# Altium schematic sheet label-signature_schematic.SchDoc
size A
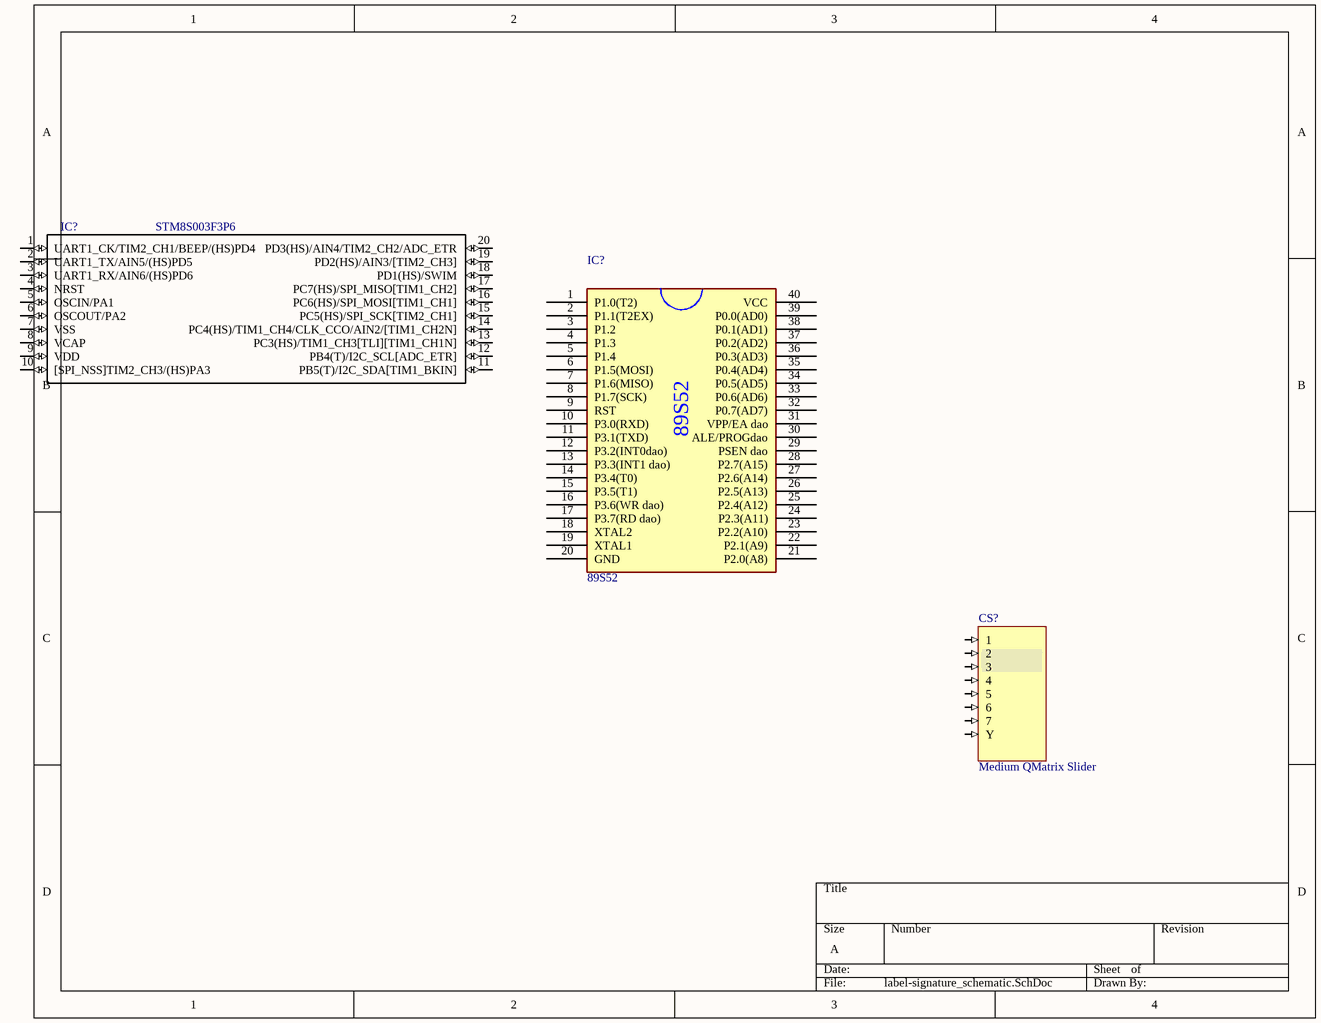
[diagram p0: label-signature_schematic.SchDoc]

## Parts
(Parts that share a designator on the sheet are numbered #1, #2 ... from top to bottom, then left to right.)
CS?  Medium QMatrix Slider  (no BOM)
IC?#1  STM8S003F3P6  [TSSOP20]
IC?#2  89S52  [89S52]

## Nets

Not connected (* = marked no-connect by the designer): CS? 1 2 3 4 5 6 7 Y; IC?#1 1(UART1_CK/TIM2_CH1/BEEP/(HS)PD4) 2(UART1_TX/AIN5/(HS)PD5) 3(UART1_RX/AIN6/(HS)PD6) 4(NRST) 5(OSCIN/PA1) 6(OSCOUT/PA2) 7(VSS) 8(VCAP) 9(VDD) 10([SPI_NSS]TIM2_CH3/(HS)PA3) 11(PB5(T)/I2C_SDA[TIM1_BKIN]) 12(PB4(T)/I2C_SCL[ADC_ETR]) 13(PC3(HS)/TIM1_CH3[TLI][TIM1_CH1N]) 14(PC4(HS)/TIM1_CH4/CLK_CCO/AIN2/[TIM1_CH2N]) 15(PC5(HS)/SPI_SCK[TIM2_CH1]) 16(PC6(HS)/SPI_MOSI[TIM1_CH1]) 17(PC7(HS)/SPI_MISO[TIM1_CH2]) 18(PD1(HS)/SWIM) 19(PD2(HS)/AIN3/[TIM2_CH3]) 20(PD3(HS)/AIN4/TIM2_CH2/ADC_ETR); IC?#2 1(P1.0(T2)) 2(P1.1(T2EX)) 3(P1.2) 4(P1.3) 5(P1.4) 6(P1.5(MOSI)) 7(P1.6(MISO)) 8(P1.7(SCK)) 9(RST) 10(P3.0(RXD)) 11(P3.1(TXD)) 12(P3.2(INT0dao)) 13(P3.3(INT1_dao)) 14(P3.4(T0)) 15(P3.5(T1)) 16(P3.6(WR_dao)) 17(P3.7(RD_dao)) 18(XTAL2) 19(XTAL1) 20(GND) 21(P2.0(A8)) 22(P2.1(A9)) 23(P2.2(A10)) 24(P2.3(A11)) 25(P2.4(A12)) 26(P2.5(A13)) 27(P2.6(A14)) 28(P2.7(A15)) 29(PSEN_dao) 30(ALE/PROGdao) 31(VPP/EA_dao) 32(P0.7(AD7)) 33(P0.6(AD6)) 34(P0.5(AD5)) 35(P0.4(AD4)) 36(P0.3(AD3)) 37(P0.2(AD2)) 38(P0.1(AD1)) 39(P0.0(AD0)) 40(VCC)

## Library data of the parts
CS? = MediumQMatrixSlider: ConfiguratorName: ATMEL_TOUCH; ConfigurationParameters: {}__sensorid[6]{}width[50]{}height[12]{}gapthickness[0.3]{}numchannels[4]{}segmentsbetweenchannels[1]{}ywidth[0.3]{}
IC?#1 = STM8S003F3P6: Mainstream Value line 8-bit MCU with 8 Kbytes Flash, 16 MHz CPU, integrated EEPROM; MF: STMicroelectronics; Package: TSSOP-20 STMicroelectronics; Price: 0.58 USD; MP: STM8S003F3P6; SnapEDA_Link: https://www.snapeda.com/symbols-footprints/STM8S003F3P6/STMicroelectronics/view-part/?ref=snap; Availability: Bad; Value: *
IC?#2 = Component_1